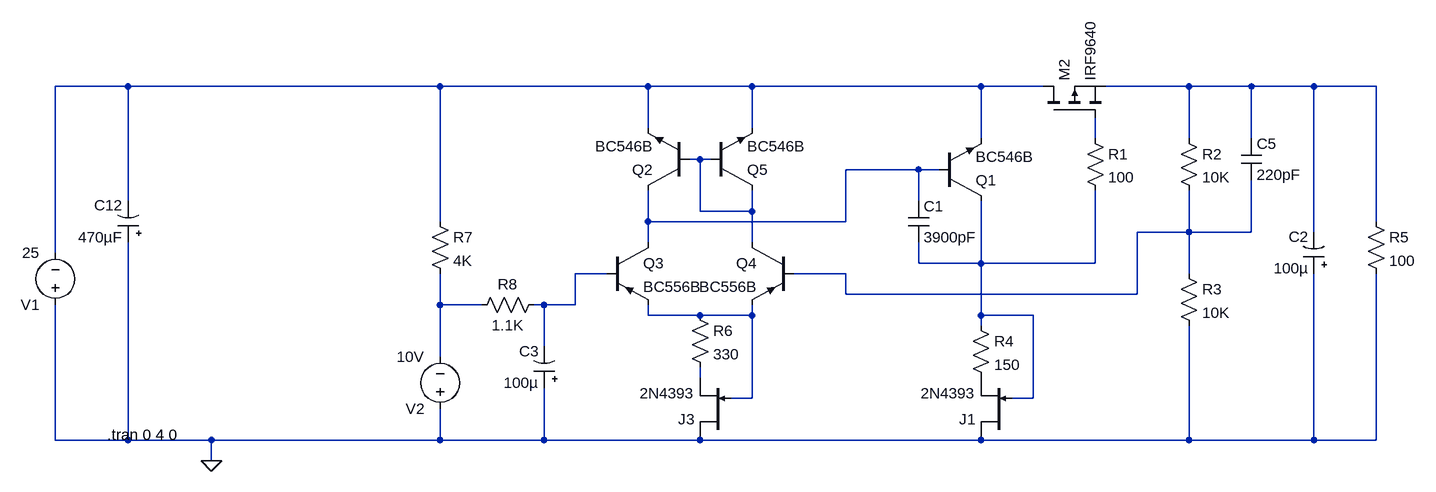
[diagram p0: schematic Sigma1neg1.asc]
Sigma1neg1.asc, the LTspice schematic file:
Version 4
SHEET 1 1892 1332
WIRE -272 112 -384 112
WIRE 208 112 -272 112
WIRE 528 112 208 112
WIRE 688 112 528 112
WIRE 1040 112 688 112
WIRE 1136 112 1040 112
WIRE 1360 112 1232 112
WIRE 1456 112 1360 112
WIRE 1552 112 1456 112
WIRE 1648 112 1552 112
WIRE 528 176 528 112
WIRE 688 176 688 112
WIRE 1040 192 1040 112
WIRE 1216 192 1216 160
WIRE 1360 192 1360 112
WIRE 1456 192 1456 112
WIRE 608 224 592 224
WIRE 624 224 608 224
WIRE 944 240 832 240
WIRE 976 240 944 240
WIRE -272 288 -272 112
WIRE 944 288 944 240
WIRE 608 304 608 224
WIRE 688 304 688 272
WIRE 688 304 608 304
WIRE 208 320 208 112
WIRE 528 320 528 272
WIRE 832 320 832 240
WIRE 832 320 528 320
WIRE 1648 320 1648 112
WIRE 1360 336 1360 272
WIRE 1360 336 1280 336
WIRE 1456 336 1456 256
WIRE 1456 336 1360 336
WIRE 1552 336 1552 112
WIRE 528 352 528 320
WIRE 688 352 688 304
WIRE -384 368 -384 112
WIRE 944 384 944 352
WIRE 1040 384 1040 288
WIRE 1040 384 944 384
WIRE 1216 384 1216 272
WIRE 1216 384 1040 384
WIRE 464 400 416 400
WIRE 832 400 752 400
WIRE 1360 400 1360 336
WIRE 832 432 832 400
WIRE 1280 432 1280 336
WIRE 1280 432 832 432
WIRE 208 448 208 400
WIRE 272 448 208 448
WIRE 368 448 352 448
WIRE 416 448 416 400
WIRE 416 448 368 448
WIRE 528 464 528 448
WIRE 608 464 528 464
WIRE 688 464 688 448
WIRE 688 464 608 464
WIRE 1040 464 1040 384
WIRE 1120 464 1040 464
WIRE 1040 480 1040 464
WIRE 368 512 368 448
WIRE 208 528 208 448
WIRE 608 560 608 544
WIRE 688 592 688 464
WIRE 688 592 656 592
WIRE 1120 592 1120 464
WIRE 1120 592 1088 592
WIRE -384 656 -384 448
WIRE -272 656 -272 352
WIRE -272 656 -384 656
WIRE -144 656 -272 656
WIRE 208 656 208 608
WIRE 208 656 -144 656
WIRE 368 656 368 576
WIRE 368 656 208 656
WIRE 608 656 368 656
WIRE 1040 656 608 656
WIRE 1360 656 1360 480
WIRE 1360 656 1040 656
WIRE 1552 656 1552 400
WIRE 1552 656 1360 656
WIRE 1648 656 1648 400
WIRE 1648 656 1552 656
WIRE -144 688 -144 656
FLAG -144 688 0
SYMBOL res 1200 176 R0
SYMATTR InstName R1
SYMATTR Value 100
SYMBOL res 1344 176 R0
SYMATTR InstName R2
SYMATTR Value 10K
SYMATTR SpiceLine tol=5
SYMBOL res 1344 384 R0
SYMATTR InstName R3
SYMATTR Value 10K
SYMATTR SpiceLine tol=5
SYMBOL res 192 304 R0
SYMATTR InstName R7
SYMATTR Value 4K
SYMBOL res 368 432 R90
WINDOW 0 0 56 VBottom 2
WINDOW 3 32 56 VTop 2
SYMATTR InstName R8
SYMATTR Value 1.1K
SYMBOL polcap 384 576 R180
WINDOW 3 24 8 Left 2
WINDOW 0 24 57 Left 2
SYMATTR Value 100µ
SYMATTR InstName C3
SYMATTR Description Capacitor
SYMATTR Type cap
SYMATTR SpiceLine V=6.3 Irms=2.9 Rser=0.018 Lser=0 mfg="KEMET" pn="A700D107M006ATE018" type="Al electrolytic"
SYMBOL cap 928 288 R0
SYMATTR InstName C1
SYMATTR Value 3900pF
SYMATTR SpiceLine V=100 Irms=4.58 Rser=0.025 Lser=0
SYMBOL cap 1440 192 R0
SYMATTR InstName C5
SYMATTR Value 220pF
SYMATTR SpiceLine V=100 Irms=4.58 Rser=0.025 Lser=0
SYMBOL polcap -256 352 R180
WINDOW 3 24 8 Left 2
WINDOW 0 24 57 Left 2
SYMATTR Value 470µF
SYMATTR InstName C12
SYMATTR Description Capacitor
SYMATTR Type cap
SYMATTR SpiceLine V=10 Irms=2.07 Rser=0.028 Lser=0
SYMBOL voltage -384 464 R180
WINDOW 123 0 0 Left 2
WINDOW 39 0 0 Left 2
SYMATTR InstName V1
SYMATTR Value 25
SYMBOL njf 1088 656 R180
SYMATTR InstName J1
SYMATTR Value 2N4393
SYMBOL res 1024 464 R0
SYMATTR InstName R4
SYMATTR Value 150
SYMBOL voltage 208 624 R180
WINDOW 123 0 0 Left 2
WINDOW 39 0 0 Left 2
SYMATTR InstName V2
SYMATTR Value 10V
SYMBOL pmos 1136 160 R270
SYMATTR InstName M2
SYMATTR Value IRF9640
SYMBOL npn 592 272 R180
SYMATTR InstName Q2
SYMATTR Value BC546B
SYMBOL pnp 752 352 M0
SYMATTR InstName Q4
SYMATTR Value BC556B
SYMBOL pnp 464 352 R0
SYMATTR InstName Q3
SYMATTR Value BC556B
SYMBOL npn 624 272 M180
SYMATTR InstName Q5
SYMATTR Value BC546B
SYMBOL polcap 1568 400 R180
WINDOW 3 24 8 Left 2
WINDOW 0 24 57 Left 2
SYMATTR Value 100µ
SYMATTR InstName C2
SYMATTR Description Capacitor
SYMATTR Type cap
SYMATTR SpiceLine V=6.3 Irms=2.9 Rser=0.018 Lser=0 mfg="KEMET" pn="A700D107M006ATE018" type="Al electrolytic"
SYMBOL res 592 448 R0
SYMATTR InstName R6
SYMATTR Value 330
SYMBOL njf 656 656 R180
SYMATTR InstName J3
SYMATTR Value 2N4393
SYMBOL res 1632 304 R0
SYMATTR InstName R5
SYMATTR Value 100
SYMBOL npn 976 288 M180
SYMATTR InstName Q1
SYMATTR Value BC546B
TEXT -304 648 Left 2 !.tran 0 4 0

The netlist it stands for:
* Sigma1neg1.asc
R1 N003 N007 100
R2 N002 N006 10K tol=5
R3 N006 0 10K tol=5
R7 N001 N009 4K
R8 N008 N009 1.1K
C3 0 N008 100µ V=6.3 Irms=2.9 Rser=0.018 Lser=0 mfg="KEMET" pn="A700D107M006ATE018" type="Al electrolytic"
C1 N005 N007 3900pF V=100 Irms=4.58 Rser=0.025 Lser=0
C5 N002 N006 220pF V=100 Irms=4.58 Rser=0.025 Lser=0
C12 0 N001 470µF V=10 Irms=2.07 Rser=0.028 Lser=0
V1 0 N001 25
J1 0 N007 P001 2N4393
R4 N007 P001 150
V2 0 N009 10V
M2 N001 N003 N002 N002 IRF9640
Q2 N005 N004 N001 0 BC546B
Q4 N004 N006 N010 0 BC556B
Q3 N005 N008 N010 0 BC556B
Q5 N004 N004 N001 0 BC546B
C2 0 N002 100µ V=6.3 Irms=2.9 Rser=0.018 Lser=0 mfg="KEMET" pn="A700D107M006ATE018" type="Al electrolytic"
R6 N010 N011 330
J3 0 N010 N011 2N4393
R5 N002 0 100
Q1 N007 N005 N001 0 BC546B
.model NPN NPN
.model PNP PNP
.lib standard.bjt
.model NJF NJF
.model PJF PJF
.lib standard.jft
.model NMOS NMOS
.model PMOS PMOS
.lib standard.mos
.tran 0 4 0
.backanno
.end